# Altium schematic sheet Display.SchDoc
size 350 x 193 mm; PageSetup: Record=PageOptions|CenterHorizontal=True|CenterVertical=True|PrintScale=0.94|XCorrection=1.00|YCorrection=1.00|PrintKind=1|BorderSize=5000000|LeftOffset=0|BottomOffset=0|Orientation=2|PaperLength=1000|PaperWidth=1000|Scale=100|PaperSource=7|PrintQuality=600|MediaType=1|DitherType=10|PaperKind=Letter|PrintScaleMode=1
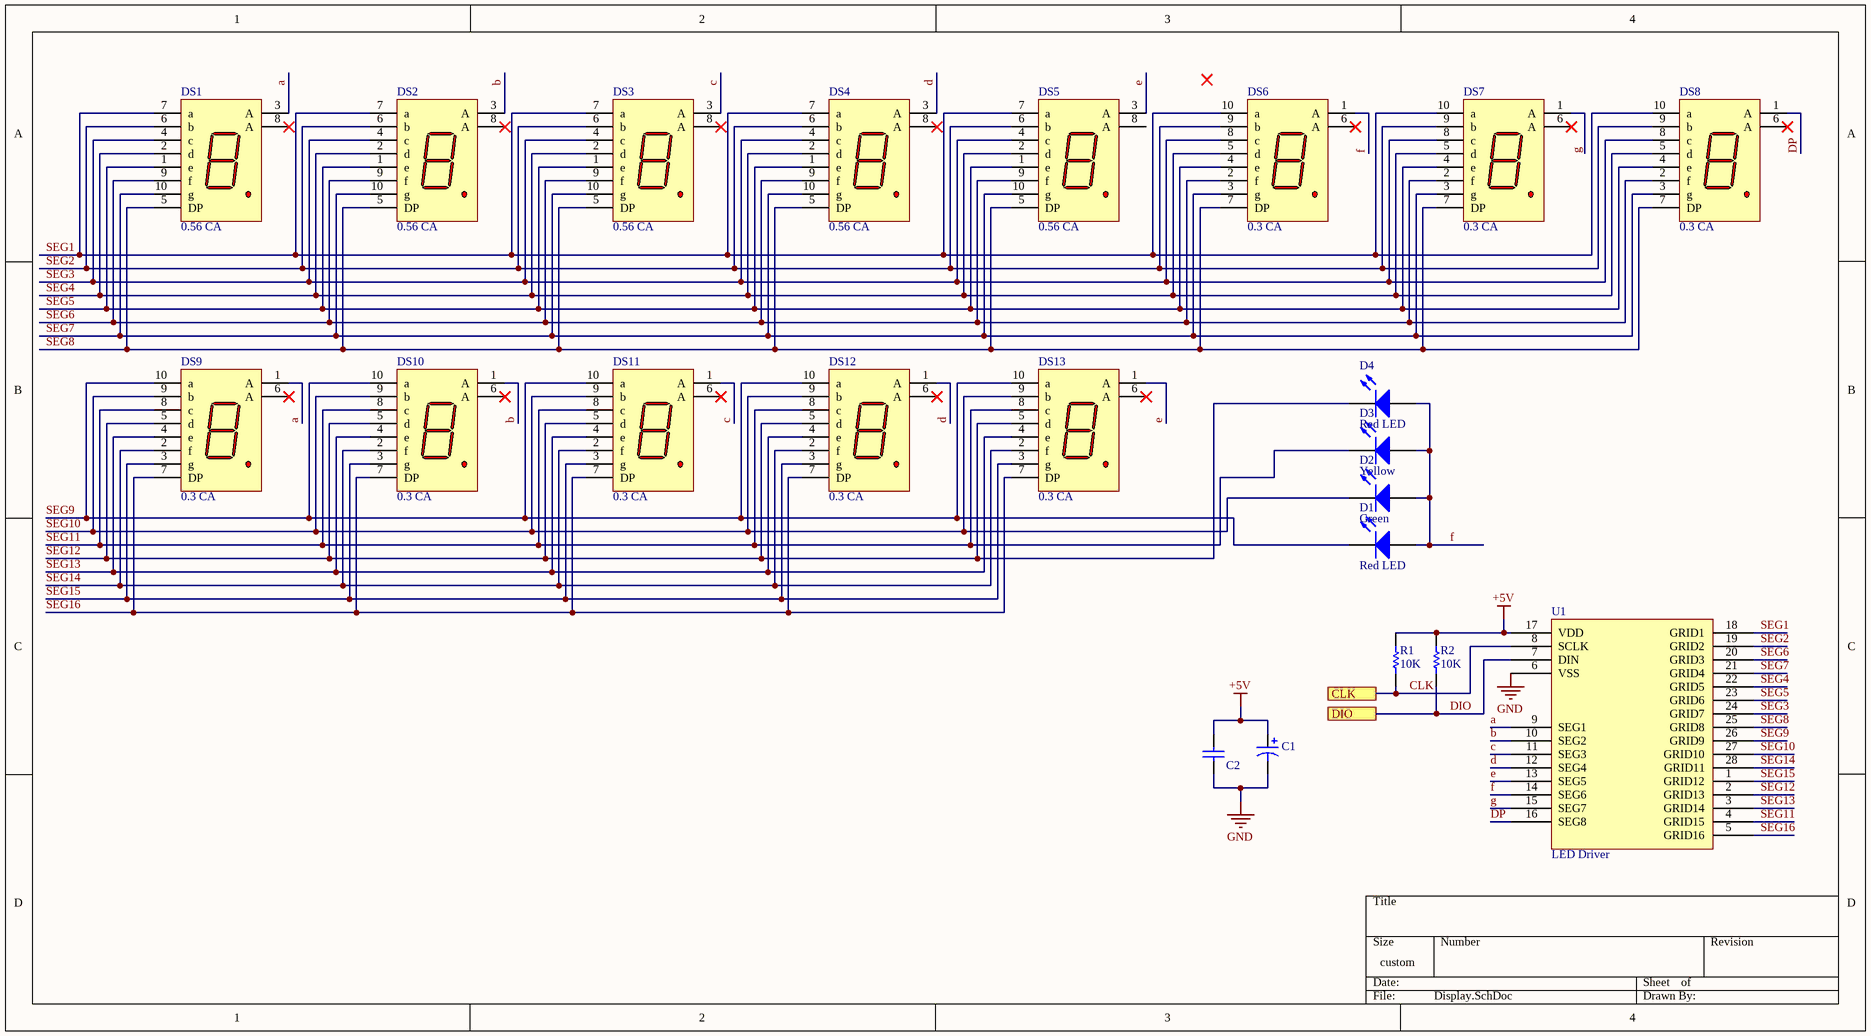
[diagram p0: Display.SchDoc]

## Parts
C1  100uF/16V  [C10uF25V]  (value not drawn)
C2  0.1uF/50V  [C0603]  (value not drawn)
D1  Red LED  [LED-5mm]
D2  Green  [LED-5mm]
D3  Yellow  [LED-5mm]
D4  Red LED  [LED-5mm]
DS1  0.56 CA  [7Segment(0.56)]
DS2  0.56 CA  [7Segment(0.56)]
DS3  0.56 CA  [7Segment(0.56)]
DS4  0.56 CA  [7Segment(0.56)]
DS5  0.56 CA  [7Segment(0.56)]
DS6  0.3 CA  [7Segment(0.36)]
DS7  0.3 CA  [7Segment(0.36)]
DS8  0.3 CA  [7Segment(0.36)]
DS9  0.3 CA  [7Segment(0.36)]
DS10  0.3 CA  [7Segment(0.36)]
DS11  0.3 CA  [7Segment(0.36)]
DS12  0.3 CA  [7Segment(0.36)]
DS13  0.3 CA  [7Segment(0.36)]
R1  10K  [R0603]
R2  10K  [R0603]
U1  LED Driver  [SOP28]

## Ports
CLK, DIO

## Nets
+5V: C1.1 C2.2 R1.2 R2.2 U1.17(VDD)
GND: C1.2 C2.1 U1.6(VSS)
a: DS1.3(A) DS9.1(A) U1.9(SEG1)
b: DS2.3(A) DS10.1(A) U1.10(SEG2)
c: DS3.3(A) DS11.1(A) U1.11(SEG3)
CLK: R1.1 U1.8(SCLK) ; port CLK
d: DS4.3(A) DS12.1(A) U1.12(SEG4)
DIO: R2.1 U1.7(DIN) ; port DIO
DP: DS8.1(A) U1.16(SEG8)
e: DS5.3(A) DS13.1(A) U1.13(SEG5)
f: D1.1(A) D2.1(A) D3.1(A) D4.1(A) DS6.1(A) U1.14(SEG6)
g: DS7.1(A) U1.15(SEG7)
SEG1: DS1.7(a) DS2.7(a) DS3.7(a) DS4.7(a) DS5.7(a) DS6.10(a) DS7.10(a) DS8.10(a) U1.18(GRID1)
SEG2: DS1.6(b) DS2.6(b) DS3.6(b) DS4.6(b) DS5.6(b) DS6.9(b) DS7.9(b) DS8.9(b) U1.19(GRID2)
SEG3: DS1.4(c) DS2.4(c) DS3.4(c) DS4.4(c) DS5.4(c) DS6.8(c) DS7.8(c) DS8.8(c) U1.24(GRID7)
SEG4: DS1.2(d) DS2.2(d) DS3.2(d) DS4.2(d) DS5.2(d) DS6.5(d) DS7.5(d) DS8.5(d) U1.22(GRID5)
SEG5: DS1.1(e) DS2.1(e) DS3.1(e) DS4.1(e) DS5.1(e) DS6.4(e) DS7.4(e) DS8.4(e) U1.23(GRID6)
SEG6: DS1.9(f) DS2.9(f) DS3.9(f) DS4.9(f) DS5.9(f) DS6.2(f) DS7.2(f) DS8.2(f) U1.20(GRID3)
SEG7: DS1.10(g) DS2.10(g) DS3.10(g) DS4.10(g) DS5.10(g) DS6.3(g) DS7.3(g) DS8.3(g) U1.21(GRID4)
SEG8: DS1.5(DP) DS2.5(DP) DS3.5(DP) DS4.5(DP) DS5.5(DP) DS6.7(DP) DS7.7(DP) DS8.7(DP) U1.25(GRID8)
SEG9: D1.2(K) DS9.10(a) DS10.10(a) DS11.10(a) DS12.10(a) DS13.10(a) U1.26(GRID9)
SEG10: D2.2(K) DS9.9(b) DS10.9(b) DS11.9(b) DS12.9(b) DS13.9(b) U1.27(GRID10)
SEG11: D3.2(K) DS9.8(c) DS10.8(c) DS11.8(c) DS12.8(c) DS13.8(c) U1.4(GRID15)
SEG12: D4.2(K) DS9.5(d) DS10.5(d) DS11.5(d) DS12.5(d) DS13.5(d) U1.2(GRID13)
SEG13: DS9.4(e) DS10.4(e) DS11.4(e) DS12.4(e) DS13.4(e) U1.3(GRID14)
SEG14: DS9.2(f) DS10.2(f) DS11.2(f) DS12.2(f) DS13.2(f) U1.28(GRID11)
SEG15: DS9.3(g) DS10.3(g) DS11.3(g) DS12.3(g) DS13.3(g) U1.1(GRID12)
SEG16: DS9.7(DP) DS10.7(DP) DS11.7(DP) DS12.7(DP) DS13.7(DP) U1.5(GRID16)

Not connected (* = marked no-connect by the designer): DS1 8(A)*; DS2 8(A)*; DS3 8(A)*; DS4 8(A)*; DS5 8(A); DS6 6(A)*; DS7 6(A)*; DS8 6(A)*; DS9 6(A)*; DS10 6(A)*; DS11 6(A)*; DS12 6(A)*; DS13 6(A)*

## Library data of the parts
C1 = Capacitor_Electrolytic: 100uF/16V Electrolytic Capacitor; Manufacturer Part Number: Standard; Case/Package: D6xH7; Mount: Yes; Value: 100uF/16V
C2 = Capacitor_Ceramic: CAP CER 0.1UF 50V X7R 0603; Manufacturer Part Number: 0603B104K500CT; Value: 0.1uF/50V; Case/Package: C0603; Mount: Yes
D1 D4 = LED: Red 645nm LED Indication - Discrete 2.1V Radial; Manufacturer Part Number: Standard; Case/Package: 5mm; Mount: Yes; Value: Red LED
D2 = LED: Green 568nm LED Indication - Discrete 2.2V Radial; Manufacturer Part Number: Standard; Case/Package: 5mm; Mount: Yes; Value: Green
D3 = LED: Yellow 585nm LED Indication - Discrete 1.8V Radial; Manufacturer Part Number: Standard; Case/Package: 5mm; Mount: Yes; Value: Yellow
DS1-DS5 = 7 Segment_CA_0.56: DISPLAY 7SEG 0.56" RED 10DIP; Manufacturer Part Number: Standard; Case/Package: 0.56; Mount: Yes; Value: 0.56 CA
DS6-DS13 = 7 Segment_CA_0.36: DISPLAY 7SEG 0.3" RED 10DIP; Manufacturer Part Number: Standard; Case/Package: 0.3"; Mount: Yes; Value: 0.3 CA
R1 R2 = Res1: RES 10K OHM 1% 1/10W 0603; Manufacturer Part Number: CR16-1002-FL; Value: 10K; Case/Package: R0603; Mount: Yes
U1 = TMXXXX: LED Drive Control Circuit; Manufacturer Part Number: TM1640; Case/Package: SOP28; Mount: Yes; Value: LED Driver